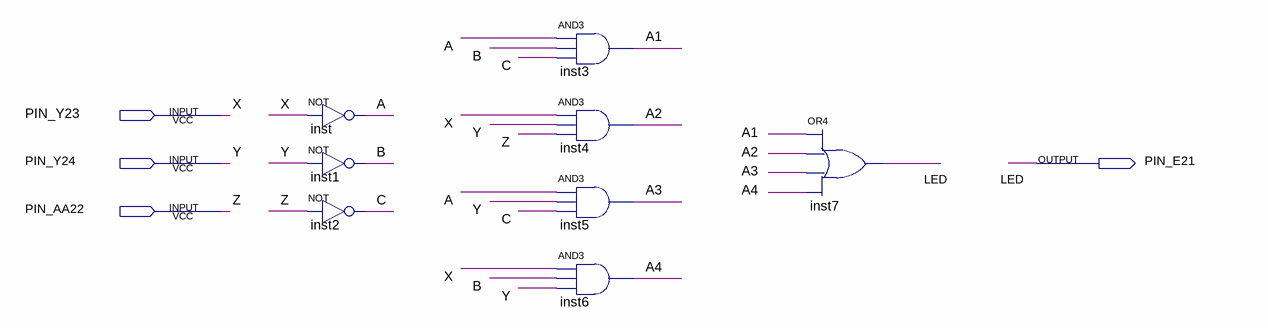
[diagram p0: schematic sheet]
// Quartus schematic Caminho_por_Nomes.bdf as structural Verilog: 8 symbols, 4 pins
module Caminho_por_Nomes (
  input  PIN_Y23,
  input  PIN_Y24,
  input  PIN_AA22,
  output PIN_E21
);

  wire A, A1, A2, A3, A4, B, C;

  not inst (A, PIN_Y23);
  not inst1 (B, PIN_Y24);
  not inst2 (C, PIN_AA22);
  and inst3 (A1, A, B, C);
  and inst4 (A2, PIN_Y23, PIN_Y24, PIN_AA22);
  and inst5 (A3, A, PIN_Y24, C);
  and inst6 (A4, PIN_Y23, B, PIN_Y24);
  or inst7 (PIN_E21, A1, A2, A3, A4);

  // Other names for the same wires on the sheet: LED = PIN_E21; X = PIN_Y23; Y = PIN_Y24; Z = PIN_AA22
endmodule
